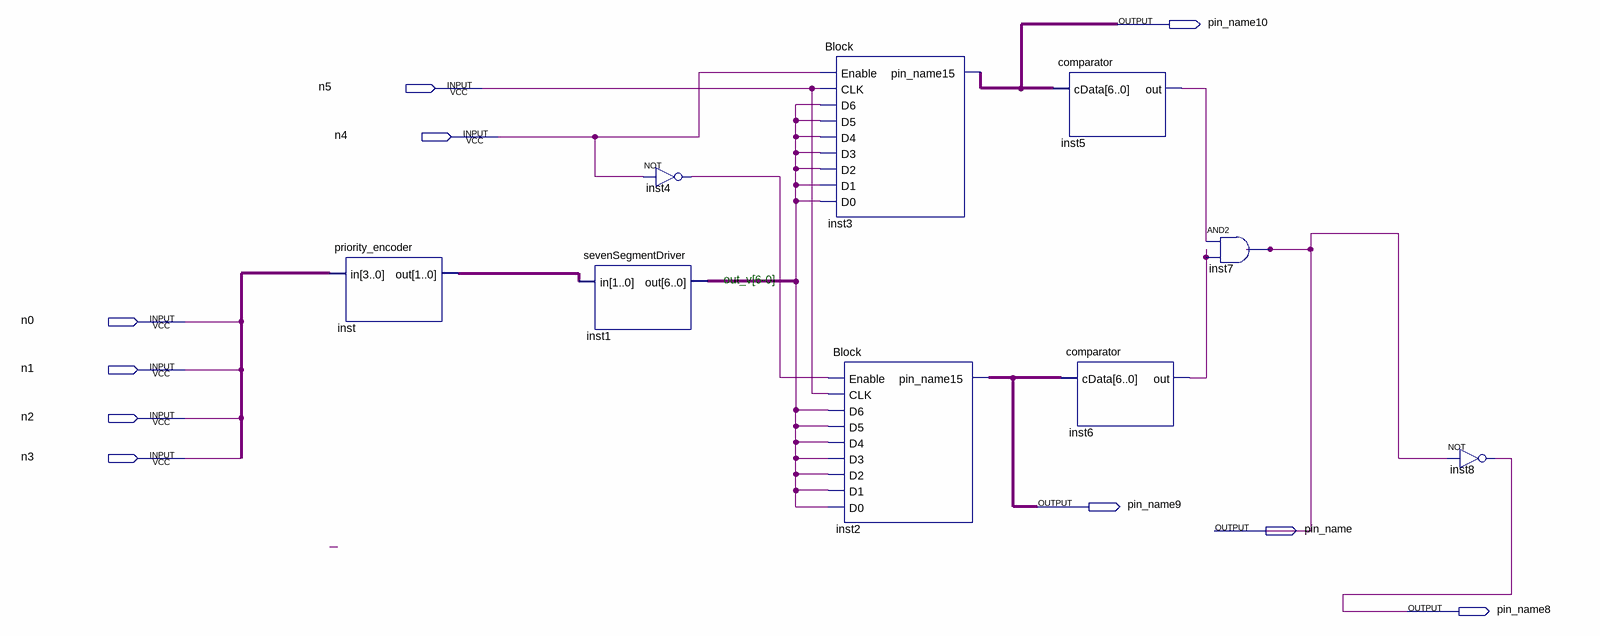
[diagram p0: schematic sheet]
// Quartus schematic final_block.bdf as structural Verilog: 9 symbols, 10 pins
module final_block (
  input  n5,
  input  n4,
  input  n0,
  input  n1,
  input  n2,
  input  n3,
  output pin_name10,
  output pin_name9,
  output pin_name,
  output pin_name8
);

  wire inst4_out, inst5_out, inst6_out, undriven;
  wire [1:0] inst_out;
  wire [3:0] undriven_2;
  wire [6:0] inst1_out, inst2_pin_name15, inst3_pin_name15;

  priority_encoder inst (.in(undriven_2), .out(inst_out));
  sevenSegmentDriver inst1 (.in(inst_out), .out(inst1_out));
  not inst4 (inst4_out, n4);
  Block inst3 (
    .Enable(n4), .CLK(n5), .D6(undriven), .D5(undriven), .D4(undriven), .D3(undriven), .D2(undriven),
    .D1(undriven), .D0(undriven), .pin_name15(inst3_pin_name15));
  Block inst2 (
    .Enable(inst4_out), .CLK(n5), .D6(undriven), .D5(undriven), .D4(undriven), .D3(undriven), .D2(undriven),
    .D1(undriven), .D0(undriven), .pin_name15(inst2_pin_name15));
  comparator inst5 (.cData(inst3_pin_name15), .out(inst5_out));
  comparator inst6 (.cData(inst2_pin_name15), .out(inst6_out));
  and inst7 (pin_name, inst5_out, inst6_out);
  not inst8 (pin_name8, pin_name);

  // Notes on the sheet:
  //   out_v[6-0]
endmodule
